# EAGLE design battery_buzzer_jig (EAGLE 6.5.0)
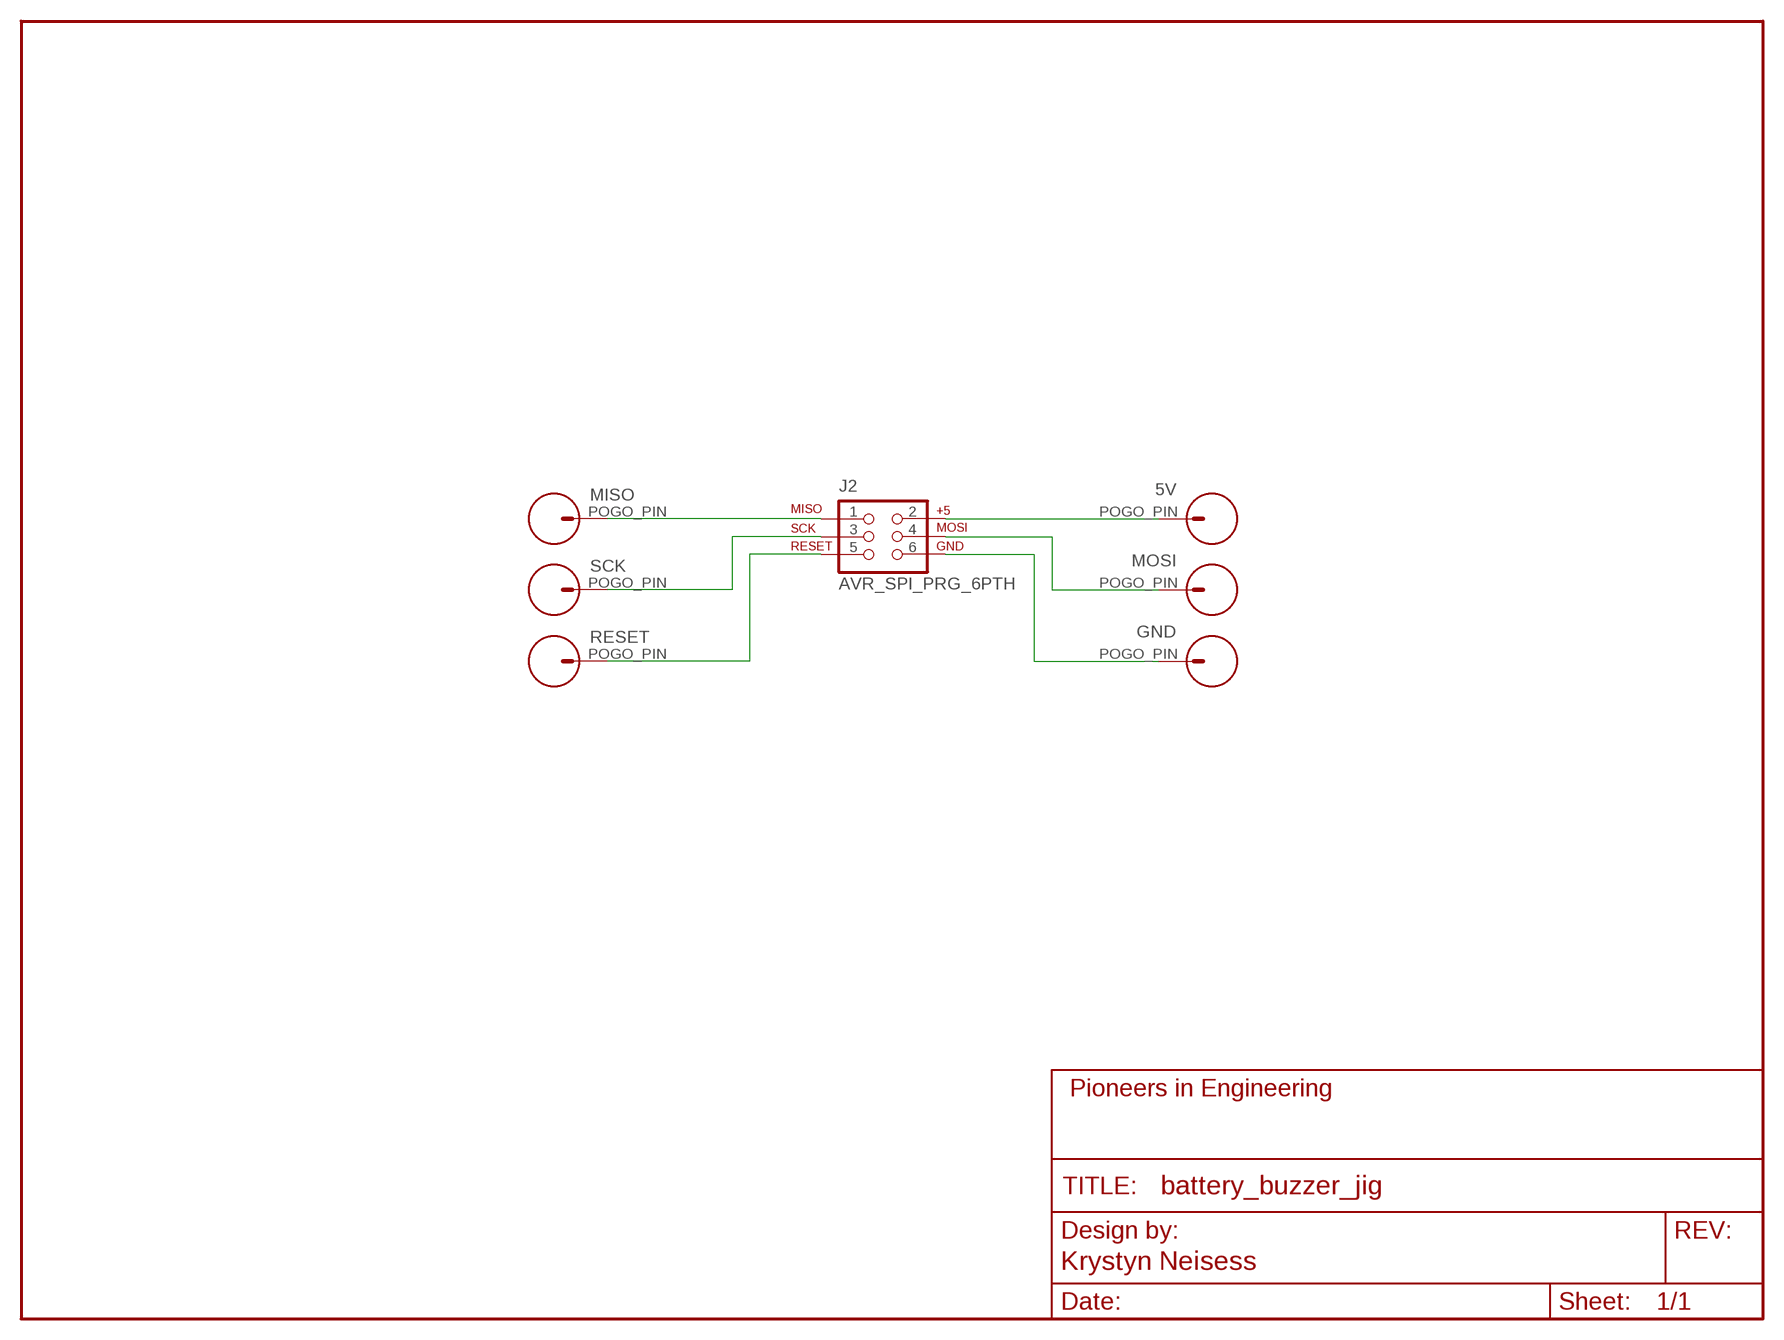
[diagram p0: schematic, sheet 1]
FRAME1 (FRAME-LETTER): AUTHOR: Krystyn Neisess; REVISION: 1A

## Parts
5V  POGO_PIN  [POGO_PIN_394]
GND  POGO_PIN  [POGO_PIN_394]
J2  AVR_SPI_PRG_6PTH  [2X3]
MISO  POGO_PIN  [POGO_PIN_394]
MOSI  POGO_PIN  [POGO_PIN_394]
RESET  POGO_PIN  [POGO_PIN_394]
SCK  POGO_PIN  [POGO_PIN_394]

## Nets
5V: 5V.POGO_PIN J2.2
A: GND.POGO_PIN J2.6
MISO: J2.1 MISO.POGO_PIN
MOSI: J2.4 MOSI.POGO_PIN
RESET: J2.5 RESET.POGO_PIN
SCK: J2.3 SCK.POGO_PIN

## Library data of the parts
5V GND MISO MOSI RESET SCK = pie:POGO_PIN: Pogo Pin Mounting/Probing Pad; PIE-INT-REF-NUM: POGO-PIN
J2 = pie:AVR_SPI_PRG_6: AVR ISP 6 Pin This is the reduced ISP connector for AVR programming. Common on Arduino. This footprint will take up less PCB space and can be used with a 10-pin to 6-pin adapter such as SKU: BOB-08508; PIE-INT-REF-NUM: BULK-STOCK

## Board
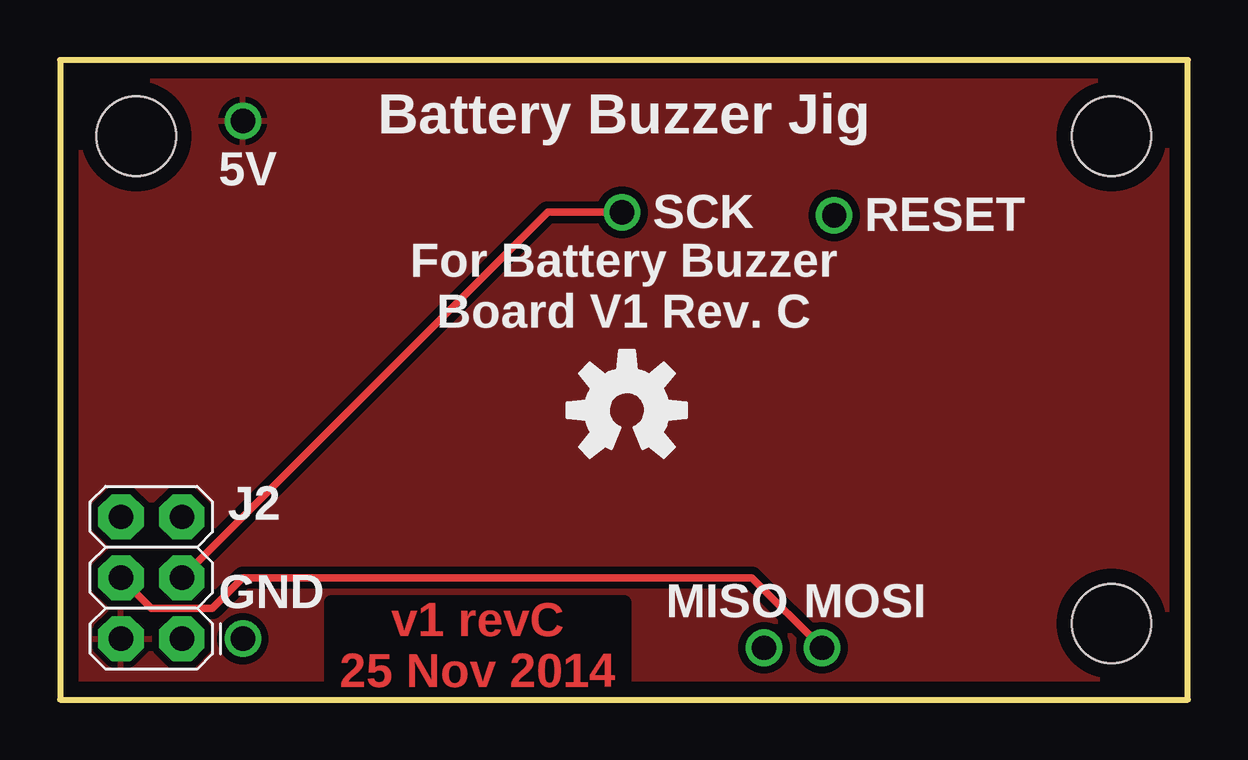
[diagram p1: board, top side]
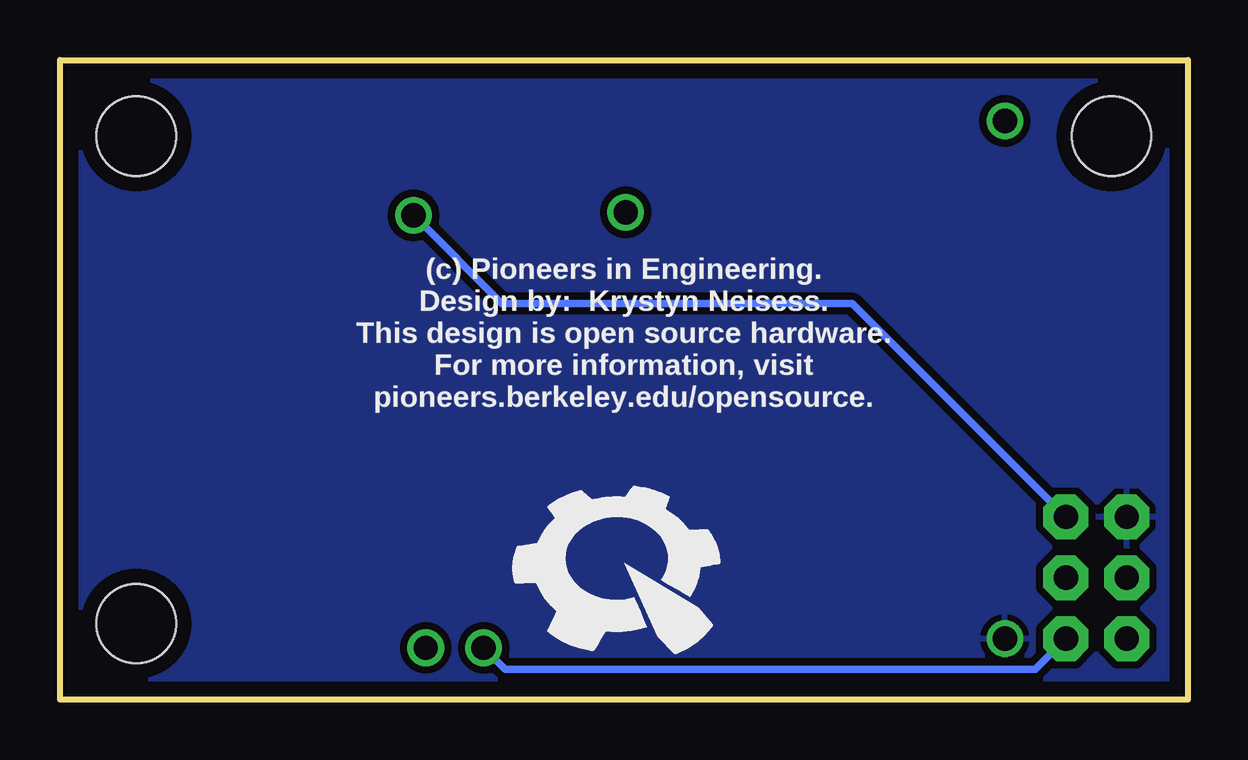
[diagram p2: board, bottom side, seen from below]

Size 46.99 x 26.67 mm. Coordinates in mm from the lower left corner, seen from the top.
Outline: 0,0 46.99,0 46.99,26.67 0,26.67 0,0
Copper layers (1*16): Top 2mil / dielectric 9mil / Bottom 2mil
Design rules "advancedcircuits-33each-pie": minimum track width 6mil, minimum drill 15mil, track to track 6mil, track to pad 6mil, pad to pad 6mil, via to via 6mil, smd to smd 6mil, copper to edge 25mil, drill to drill 7mil, minimum pad ring 7mil, minimum via ring 7mil, stop-mask expansion 3mil, vias tented up to drill 21mil, thermal gap 10mil

### Footprints (pad centres in the part's own frame; a part is rotated, then mirrored left to right if it is on the bottom)
POGO_PIN_394 = drill 1.016 pad 1.524: POGO_PIN 0,0
2X3 = drill 1.016 pad 1.88 octagon: 1 0,0; 2 0,2.54; 3 2.54,0; 4 2.54,2.54; 5 5.08,0; 6 5.08,2.54
STAND-OFF = hole 3.302: 0,0

### Placement (x,y rotation side)
5V  7.62,24.13 270 top
GND  7.62,2.54 90 top
J2  5.08,2.54 90 top
MISO  29.34,2.16 0 top
MOSI  31.75,2.16 0 top
RESET  32.26,20.19 270 top
SCK  23.42,20.32 0 top
U$1  [OSHW-LOGO-M]  23.62,12.06 0 top
U$2  [PIE-LOGO-SMALL]  23.5,5.71 0 bottom
U$3  [STAND-OFF]  43.81,3.17 0 top
U$4  [STAND-OFF]  3.17,23.5 0 top
U$5  [STAND-OFF]  43.81,23.5 0 top

### Tracks (layer width: path | path; a pad name or v marks a point on that pad's centre or on a via)
5V
  pour Top (isolate 0.305): 0,0 0,26.67 46.99,26.67 46.99,0
A
  pour Bottom (isolate 0.305): 0,0 0,26.67 46.99,26.67 46.99,0
MISO
  Bottom 0.305: MISO.POGO_PIN 28.45,1.27 6.35,1.27 J2.1
MOSI
  Top 0.305: MOSI.POGO_PIN 28.83,5.08 7.62,5.08 6.35,3.81 3.81,3.81 J2.4
RESET
  Bottom 0.305: J2.5 13.97,16.51 28.57,16.51 RESET.POGO_PIN
SCK
  Top 0.305: J2.3 20.32,20.32 SCK.POGO_PIN

### Text on the board
Top: v1 revC / 25 Nov 2014
tPlace: Battery Buzzer Jig | For Battery Buzzer / Board V1 Rev. C
bPlace: (c) Pioneers in Engineering. / Design by: Krystyn Neisess. / This design is open source hardware. / For more information, visit / pioneers.berkeley.edu/opensource.